# EAGLE schematic MouseSchematic (EAGLE 9.7.0)
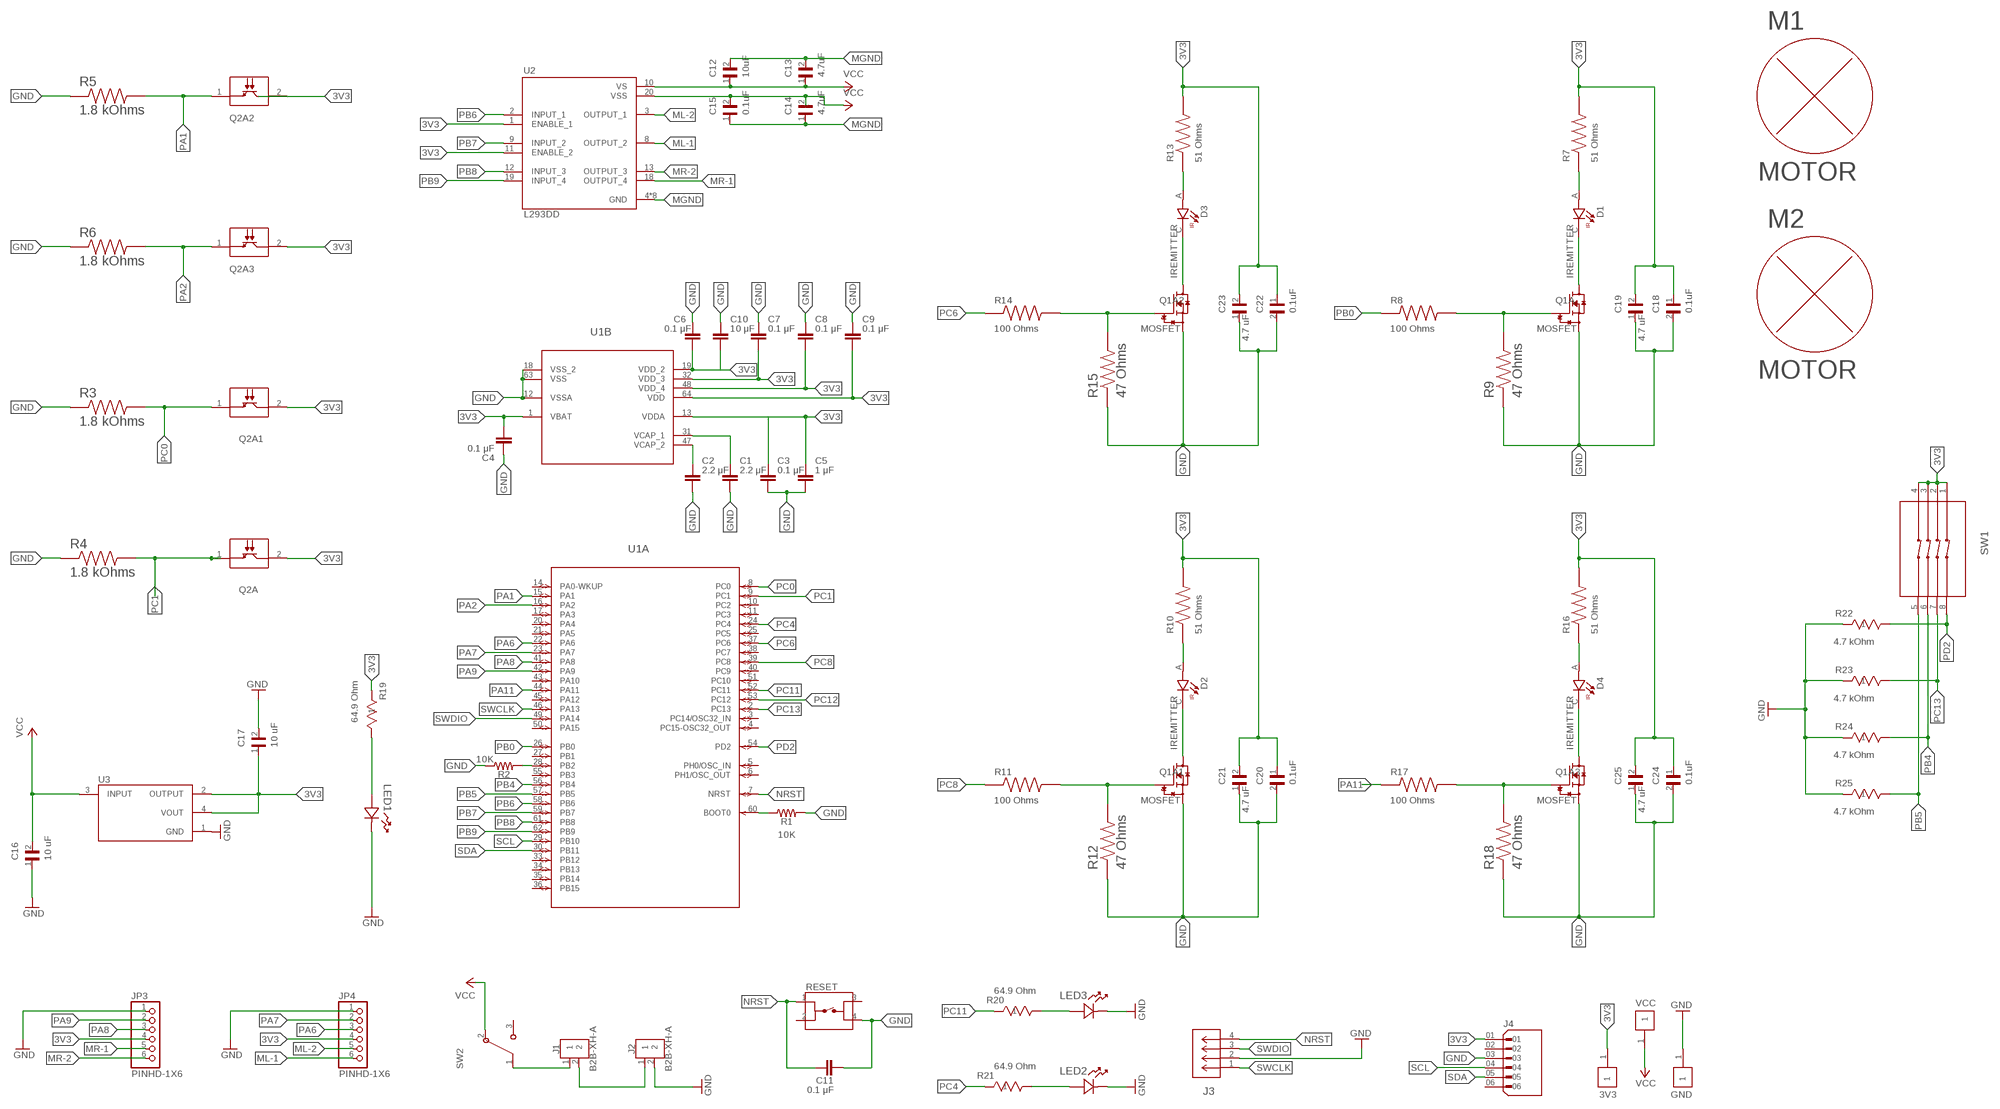
[diagram p0: schematic, sheet 1]

## Parts
3V3  5000  [KEYSTONE_5000]
C1  2.2 μF  C_CHIP-0603(1608-METRIC)  [CAPC1608X85]
C2  2.2 μF  C_CHIP-0603(1608-METRIC)  [CAPC1608X85]
C3  0.1 μF  C_CHIP-0603(1608-METRIC)  [CAPC1608X85]
C4  0.1 μF  C_CHIP-0603(1608-METRIC)  [CAPC1608X85]
C5  1 μF  C_CHIP-0603(1608-METRIC)  [CAPC1608X85]
C6  0.1 μF  C_CHIP-0603(1608-METRIC)  [CAPC1608X85]
C7  0.1 μF  C_CHIP-0603(1608-METRIC)  [CAPC1608X85]
C8  0.1 μF  C_CHIP-0603(1608-METRIC)  [CAPC1608X85]
C9  0.1 μF  C_CHIP-0603(1608-METRIC)  [CAPC1608X85]
C10  10 μF  C_CHIP-0603(1608-METRIC)  [CAPC1608X85]
C11  0.1 μF  C_CHIP-0603(1608-METRIC)  [CAPC1608X85]
C12  10uF  GRM21BR61C106KE15L  [CAPC2012X135N]
C13  4.7uF  GRM21BR71C475KE51L  [CAPC2012X140N]
C14  4.7uF  GRM21BR71C475KE51L  [CAPC2012X140N]
C15  0.1uF  C0805C104K4RAC  [CAPC2012X88N]
C16  10 uF  GRM21BR61C106KE15L  [CAPC2012X135N]
C17  10 uF  C2012X5R1C226K125AC  [CAPC2012X145N]
C18  0.1uF  CL21B104KCFNNNE  [CAPC2012X140N]
C19  4.7 uF  GRM21BR71C475KE51L  [CAPC2012X140N]
C20  0.1uF  CL21B104KCFNNNE  [CAPC2012X140N]
C21  4.7 uF  GRM21BR71C475KE51L  [CAPC2012X140N]
C22  0.1uF  CL21B104KCFNNNE  [CAPC2012X140N]
C23  4.7 uF  GRM21BR71C475KE51L  [CAPC2012X140N]
C24  0.1uF  CL21B104KCFNNNE  [CAPC2012X140N]
C25  4.7 uF  GRM21BR71C475KE51L  [CAPC2012X140N]
D1  IREMITTER  TSAL6200  [LEDRD254W55D595H900]
D2  IREMITTER  TSAL6200  [LEDRD254W55D595H900]
D3  IREMITTER  TSAL6200  [LEDRD254W55D595H900]
D4  IREMITTER  TSAL6200  [LEDRD254W55D595H900]
GND  5000  [KEYSTONE_5000]
J1  B2B-XH-A  [B2B-XH-A]
J2  B2B-XH-A  [B2B-XH-A]
J3  PPTC041LFBN-RCCONN_PPTC041LFBN-RC_SUL  [CONN_PPTC041LFBN-RC_SUL]
J4  61300611121  [WURTH_61300611121]
JP3  PINHD-1X6  [1X06]
JP4  PINHD-1X6  [1X06]
LED1  CMD17-21VGD_TR8  [LED_CMD17-21VGD_TR8]
LED2  CMD17-21VGD_TR8  [LED_CMD17-21VGD_TR8]
LED3  CMD17-21VGD_TR8  [LED_CMD17-21VGD_TR8]
M1  MOTOR  [MOTOR]
M2  MOTOR  [MOTOR]
Q1A  MOSFET  NX7002AK,215  [SOT95P230X110-3N]
Q1A1  MOSFET  NX7002AK,215  [SOT95P230X110-3N]
Q1A2  MOSFET  NX7002AK,215  [SOT95P230X110-3N]
Q1A3  MOSFET  NX7002AK,215  [SOT95P230X110-3N]
Q2A  LTR-4206ENONEP157X157-2_LTO  [NONEP157X157-2_LTO]
Q2A1  LTR-4206ENONEP157X157-2_LTO  [NONEP157X157-2_LTO]
Q2A2  LTR-4206ENONEP157X157-2_LTO  [NONEP157X157-2_LTO]
Q2A3  LTR-4206ENONEP157X157-2_LTO  [NONEP157X157-2_LTO]
R1  10K  R-US_CHIP-0603(1608-METRIC)  [RESC1608X60]
R2  10K  R-US_CHIP-0603(1608-METRIC)  [RESC1608X60]
R3  1.8 kOhms  RMCF0805JT1K80  [RESC2012X65N]
R4  1.8 kOhms  RMCF0805JT1K80  [RESC2012X65N]
R5  1.8 kOhms  RMCF0805JT1K80  [RESC2012X65N]
R6  1.8 kOhms  RMCF0805JT1K80  [RESC2012X65N]
R7  51 Ohms  RC0805FR-073R48L  [RESC2012X60N]
R8  100 Ohms  RC0805FR-07100RL  [RESC2012X60N]
R9  47 Ohms  RMCF0805JT47K0  [RESC2012X65N]
R10  51 Ohms  RC0805FR-073R48L  [RESC2012X60N]
R11  100 Ohms  RC0805FR-07100RL  [RESC2012X60N]
R12  47 Ohms  RMCF0805JT47K0  [RESC2012X65N]
R13  51 Ohms  RC0805FR-073R48L  [RESC2012X60N]
R14  100 Ohms  RC0805FR-07100RL  [RESC2012X60N]
R15  47 Ohms  RMCF0805JT47K0  [RESC2012X65N]
R16  51 Ohms  RC0805FR-073R48L  [RESC2012X60N]
R17  100 Ohms  RC0805FR-07100RL  [RESC2012X60N]
R18  47 Ohms  RMCF0805JT47K0  [RESC2012X65N]
R19  64.9 Ohm  RMCF0805FT64R9RES_RMCF0805_STP-L  [RES_RMCF0805_STP-L]
R20  64.9 Ohm  RMCF0805FT64R9RES_RMCF0805_STP-L  [RES_RMCF0805_STP-L]
R21  64.9 Ohm  RMCF0805FT64R9RES_RMCF0805_STP-L  [RES_RMCF0805_STP-L]
R22  4.7 kOhm  RMCF0805JT4K70STA_RMCF0805_STP-L  [STA_RMCF0805_STP-L]
R23  4.7 kOhm  RMCF0805JT4K70STA_RMCF0805_STP-L  [STA_RMCF0805_STP-L]
R24  4.7 kOhm  RMCF0805JT4K70STA_RMCF0805_STP-L  [STA_RMCF0805_STP-L]
R25  4.7 kOhm  RMCF0805JT4K70STA_RMCF0805_STP-L  [STA_RMCF0805_STP-L]
RESET  FSM4JSMA  [TE_FSM4JSMA]
SW1  219-4MSTR219-4-M_CTS-L  [219-4-M_CTS-L]
SW2  EG1218SW_1218_EWI  [SW_1218_EWI]
U1  STM32F205RGT6  [LQFP64-10X10MM]
U2  L293DD  [SOIC127P1032X265-20N]
U3  AZ1117IH-3.3TRG1  [SOT230P700X185-4N]
VCC  5000  [KEYSTONE_5000]

## Nets
3V3: 3V3.1 C3.1 C4.2 C5.1 C6.2 C7.2 C8.2 C9.2 C10.2 C17.1 C18.1 C19.2 C20.1 C21.2 C22.1 C23.2 C24.1 C25.2 J4.01 JP3.4 JP4.4 Q2A1.2 Q2A2.2 Q2A3.2 Q2A.2 R7.2 R10.2 R13.2 R16.2 R19.1 SW1.1 SW1.2 SW1.3 SW1.4 U1.1(B:VBAT) U1.13(B:VDDA) U1.19(B:VDD_2) U1.32(B:VDD_3) U1.48(B:VDD_4) U1.64(B:VDD) U2.1(ENABLE_1) U2.11(ENABLE_2) U3.2(OUTPUT) U3.4(VOUT)
GND: C1.2 C2.2 C3.2 C4.1 C5.2 C6.1 C7.1 C8.1 C9.1 C10.1 C11.2 C16.1 C17.2 C18.2 C19.1 C20.2 C21.1 C22.2 C23.1 C24.2 C25.1 GND.1 J2.2 J3.2 J4.03 JP3.1 JP4.1 LED1.2 LED2.2 LED3.2 Q1A1.2(S) Q1A2.2(S) Q1A3.2(S) Q1A.2(S) R1.2 R2.1 R3.1 R4.1 R5.1 R6.1 R9.1 R12.1 R15.1 R18.1 R22.1 R23.1 R24.1 R25.1 RESET.4 U1.12(B:VSSA) U1.18(B:VSS_2) U1.63(B:VSS) U3.1(GND)
MGND: C12.2 C13.2 C14.1 C15.1 U2.4(GND) U2.5(GND) U2.6(GND) U2.7(GND) U2.14(GND) U2.15(GND) U2.16(GND) U2.17(GND)
ML-1: JP4.6 U2.8(OUTPUT_2)
ML-2: JP4.5 U2.3(OUTPUT_1)
MR-1: JP3.5 U2.18(OUTPUT_4)
MR-2: JP3.6 U2.13(OUTPUT_3)
N$1: C1.1 U1.31(B:VCAP_1)
N$2: C2.1 U1.47(B:VCAP_2)
N$3: R1.1 U1.60(A:BOOT0)
N$4: R2.2 U1.28(A:PB2)
N$5: D1.A R7.1
N$6: Q1A.1(G) R8.2 R9.2
N$7: J1.2 J2.1
N$8: J1.1 SW2.1
N$9: D1.C Q1A.3(D)
N$10: D2.A R10.1
N$11: Q1A1.1(G) R11.2 R12.2
N$12: D2.C Q1A1.3(D)
N$13: D3.A R13.1
N$14: Q1A2.1(G) R14.2 R15.2
N$15: D3.C Q1A2.3(D)
N$16: D4.A R16.1
N$17: Q1A3.1(G) R17.2 R18.2
N$18: D4.C Q1A3.3(D)
N$19: LED3.1 R20.2
N$20: LED2.1 R21.2
N$21: LED1.1 R19.2
NRST: C11.1 J3.4 RESET.1 U1.7(A:NRST)
PA1: Q2A2.1 R5.2 U1.15(A:PA1)
PA2: Q2A3.1 R6.2 U1.16(A:PA2)
PA6: JP4.3 U1.22(A:PA6)
PA7: JP4.2 U1.23(A:PA7)
PA8: JP3.3 U1.41(A:PA8)
PA9: JP3.2 U1.42(A:PA9)
PA11: R17.1 U1.44(A:PA11)
PB0: R8.1 U1.26(A:PB0)
PB4: R24.2 SW1.6 U1.56(A:PB4)
PB5: R25.2 SW1.5 U1.57(A:PB5)
PB6: U1.58(A:PB6) U2.2(INPUT_1)
PB7: U1.59(A:PB7) U2.9(INPUT_2)
PB8: U1.61(A:PB8) U2.12(INPUT_3)
PB9: U1.62(A:PB9) U2.19(INPUT_4)
PC0: Q2A1.1 R3.2 U1.8(A:PC0)
PC1: Q2A.1 R4.2 U1.9(A:PC1)
PC4: R21.1 U1.24(A:PC4)
PC6: R14.1 U1.37(A:PC6)
PC8: R11.1 U1.39(A:PC8)
PC11: R20.1 U1.52(A:PC11)
PC12: U1.53(A:PC12)
PC13: R23.2 SW1.7 U1.2(A:PC13)
PD2: R22.2 SW1.8 U1.54(A:PD2)
SCL: J4.04 U1.29(A:PB10)
SDA: J4.05 U1.30(A:PB11)
SWCLK: J3.1 U1.46(A:PA13)
SWDIO: J3.3 U1.49(A:PA14)
VCC: C12.1 C13.1 C14.2 C15.2 C16.2 SW2.2 U2.10(VS) U2.20(VSS) U3.3(INPUT) VCC.1
Unconnected: J4.02 J4.06 RESET.2 RESET.3 SW2.3 U1.3(A:PC14/OSC32_IN) U1.4(A:PC15-OSC32_OUT) U1.5(A:PH0/OSC_IN) U1.6(A:PH1/OSC_OUT) U1.10(A:PC2) U1.11(A:PC3) U1.14(A:PA0-WKUP) U1.17(A:PA3) U1.20(A:PA4) U1.21(A:PA5) U1.25(A:PC5) U1.27(A:PB1) U1.33(A:PB12) U1.34(A:PB13) U1.35(A:PB14) U1.36(A:PB15) U1.38(A:PC7) U1.40(A:PC9) U1.43(A:PA10) U1.45(A:PA12) U1.50(A:PA15) U1.51(A:PC10) U1.55(A:PB3)

## Library data of the parts
3V3 GND VCC = Keystone Test Point:5000: Check availability <https://pricing.snapeda.com/parts/5000/Keystone%20Electronics/view-part?ref=eda>; AVAILABILITY: In Stock; DESCRIPTION: PC Test Point - Miniature; MF: Keystone Electronics; MP: 5000; PACKAGE: Test Point Keystone Electronics; PRICE: None; PURCHASE-URL: https://pricing.snapeda.com/search/part/5000/?ref=eda
C1-C6 = Capacitor:C: Capacitor - Generic; CATEGORY: Capacitor
C7-C11 = Capacitor2:C: Capacitor - Generic; CATEGORY: Capacitor
C12 C16 = Capacitor 10 uF:GRM21BR61C106KE15L
C13 C14 C19 C21 C23 C25 = Capacitor 4.7uF:GRM21BR71C475KE51L: SMD Capacitor X7R(EIA) with Capacitance: 4.7uF Tol. 10%. Rated Voltage: 16Vdc
C15 = C0805C104K4RAC:C0805C104K4RAC: Cap Ceramic 0.1uF 16V X7R 10% Pad SMD 0805 125C Bulk; CHECK_PRICES: https://www.snapeda.com/parts/C0805C104K4RAC/KEMET/view-part/?ref=eda; DESCRIPTION: 0.1µF ±10% 16V Ceramic Capacitor X7R 0805 (2012 Metric); MF: KEMET; MP: C0805C104K4RAC; PACKAGE: 0805 Kemet; SNAPEDA_LINK: https://www.snapeda.com/parts/C0805C104K4RAC/KEMET/view-part/?ref=snap
C17 = Capacitor_22uF:C2012X5R1C226K125AC: 22µF ±10% 16V Ceramic Capacitor X5R 0805 (2012 Metric)
C18 C20 C22 C24 = Cap0-1uF:CL21B104KCFNNNE: CL21 Series 0.1 uF 100V ±10 % Tolerance X7R SMT Multilayer Ceramic Capacitor
D1-D4 = emitter:TSAL6200: 940 nm 100 mA ±17° Through Hole High Power Infrared Emitting Diode - T-1 3/4; MANUFACTURER: Vishay; MAXIMUM_PACKAGE_HEIGHT: 9.0 mm; PARTREV: 2.4; STANDARD: IPC-7351B
J1 J2 = Connector:B2B-XH-A: XH Connector Top Entry - 2POS Details see: Datasheet <http://www.jst-mfg.com/product/pdf/eng/eXH.pdf>; CATEGORY: Header; DESCRIPTION: Connector Header Through Hole 2 position 0.098" (2.50mm); MANUFACTURER: JST Sales America Inc.; MPN: B2B-XH-A(LF)(SN); OPERATING_TEMPERATURE: -25°C ~ 85°C; PART_STATUS: ACTIVE; PITCH: 0.098" (2.50mm); ROHS_COMPLIANCE: ROHS3 Compliant; SERIES: XH; SUB_CATEGORY: Rectangular Connectors; TYPE: Header, Male Pin, Board to Cable/Wire, Through Hole
J3 = programmingheader:PPTC041LFBN-RC; COPYRIGHT: Copyright (C) 2024 Ultra Librarian. All rights reserved.; MANUFACTURER_PART_NUMBER: PPTC041LFBN-RC; MFR_NAME: Sullins
J4 = IMU_header:61300611121: Check availability <https://pricing.snapeda.com/parts/61300611121/W%C3%BCrth%20Elektronik/view-part?ref=eda>; AVAILABILITY: In Stock; DESCRIPTION: Connector Header Through Hole 6 position 0.100 (2.54mm); MF: Würth Elektronik; MP: 61300611121; PACKAGE: None; PRICE: None; PURCHASE-URL: https://pricing.snapeda.com/search/part/61300611121/?ref=eda
JP3 JP4 = Connector:PINHD-1X6: PIN HEADER; CATEGORY: Headers; DESCRIPTION: Header, Straight, 6 Position; MANUFACTURER: Generic; MPN: Generic; OPERATING_TEMPERATURE: Generic; PART_STATUS: Active; PITCH: 0.100" (2.54mm); ROHS_COMPLIANCE: Generic; SERIES: Generic; SUB-CATEGORY: Headers, Male Pins; TYPE: Board to Board or Cable, Unshrouded, Through Hole, Straight
LED1-LED3 = SNAPgreenLED:CMD17-21VGD_TR8: LED, GREEN, 7MCD, 570NM; LEDCOLOR: Green; MPN: CMD17-21VGD_TR8; OC_FARNELL: -; OC_NEWARK: 34C8662; PACKAGE: 2 -PIN LED; SUPPLIER: CHICAGO MINIATURE LIGHTING
M1 M2 = micromouseMotors:MOTOR
Q1A Q1A1-Q1A3 = MOSFET_SMD:NX7002AK,215: N-Channel 60 V 4.5 Ohm 265 mW 0.33 nC Surface Mount Mosfet - SOT-23; MANUFACTURER: Nexperia; MAXIMUM_PACKAGE_HEIGHT: 1.1mm; PARTREV: 7; STANDARD: IPC-7351B
Q2A Q2A1-Q2A3 = Phototransistor:LTR-4206E; COPYRIGHT: Copyright (C) 2024 Ultra Librarian. All rights reserved.; MANUFACTURER_PART_NUMBER: LTR-4206E; MFR_NAME: LITE-ON
R1 R2 = Resistor2:R-US: Resistor Fixed - ANSI; CATEGORY: Resistor; SUB-CATEGORY: Fixed
R3-R6 = Resistor1.8kOhms:RMCF0805JT1K80; CHECK_PRICES: https://www.snapeda.com/parts/RMCF0805JT1K80/Stackpole+Electronics+Inc/view-part/?ref=eda; DESCRIPTION: 1.8 kOhms ±5% 0.125W, 1/8W Chip Resistor 0805 (2012 Metric) Automotive AEC-Q200 Thick Film; DIGIKEY_PART_NUMBER: RMCF0805JT1K80TR-ND; MF: Stackpole Electronics Inc; MP: RMCF0805JT1K80; PACKAGE: 2012 Stackpole; PURCHASE-URL: https://www.snapeda.com/api/url_track_click_mouser/?unipart_id=3950781&manufacturer=Stackpole Electronics Inc&part_name=RMCF0805JT1K80&search_term=None; SNAPEDA_LINK: https://www.snapeda.com/parts/RMCF0805JT1K80/Stackpole+Electronics+Inc/view-part/?ref=snap
R7 R10 R13 R16 = LEDCurrentResistor51Ohms:RC0805FR-073R48L: Res Thick Film 0805 3.48 Ohm 1% 0.125W(1/8W) ±200ppm/C Epoxy Pad SMD T/R
R8 R11 R14 R17 = MCU Pin Current Limiter Resistor 100 Ohms:RC0805FR-07100RL: Resistor SMD [YAGEO] RC0805FR-07100RL Resistor SMD
R9 R12 R15 R18 = RMCF0805JT47K0:RMCF0805JT47K0
R19-R21 = Resistor64.9Ohm:RMCF0805FT64R9; COPYRIGHT: Copyright (C) 2024 Ultra Librarian. All rights reserved.; MANUFACTURER_PART_NUMBER: RMCF0805FT64R9; MFR_NAME: Stackpole International
R22-R25 = PullDownResistor4.7Ohms:RMCF0805JT4K70; COPYRIGHT: Copyright (C) 2024 Ultra Librarian. All rights reserved.; MANUFACTURER_PART_NUMBER: RMCF0805JT4K70; MFR_NAME: Stackpole International
RESET = FSM4JSMA:FSM4JSMA: Switch Tactile OFF (ON) SPST Round Button Gull Wing 0.05A 24VDC 2.6N SMD T/R; COMMENT: 4-1437565-1; CONFIGURATION_POLE-THROW: Single Pole - Single Throw; CONTACT_CURRENT_RATING: 50 mA; DESCRIPTION: Tactile Switch SPST-NO Top Actuated Surface Mount; DIGI-KEY_PART_NUMBER: 450-1759-2-ND; EU_ROHS_COMPLIANCE: Compliant; MF: TE Connectivity; MP: FSM4JSMA; PACKAGE: None; PURCHASE-URL: https://pricing.snapeda.com/search/part/FSM4JSMA/?ref=eda
SW1 = DipSwitch4Pin:219-4MSTR; COPYRIGHT: Copyright (C) 2024 Ultra Librarian. All rights reserved.; MANUFACTURER_PART_NUMBER: 219-4MSTR; MFR_NAME: CTS Components
SW2 = powerswitch:EG1218; COPYRIGHT: Copyright (C) 2024 Ultra Librarian. All rights reserved.; MANUFACTURER_PART_NUMBER: EG1218; MFR_NAME: E-Switch
U1 = stm32f205rgt6:STM32F205RGT6; COPYRIGHT: Copyright (C) 2021 Ultra Librarian. All rights reserved.; MANUFACTURER_PART_NUMBER: STM32F205RGT6; MFR_NAME: STMicroelectronics
U2 = L293DD:L293DD: L293DD Series Push - Pull Quad Channel Driver with Diodes - SOIC-20; MANUFACTURER: STMicroelectronics; PARTREV: N/A; STANDARD: IPC-7351B
U3 = AZ1117IH-3.3TRG1:AZ1117IH-3.3TRG1: Check availability <https://pricing.snapeda.com/parts/AZ1117IH-3.3TRG1/Diodes%20Inc./view-part?ref=eda>; AVAILABILITY: In Stock; CHECK_PRICES: https://www.snapeda.com/parts/AZ1117IH-3.3TRG1/Diodes+Inc./view-part/?ref=eda; DESCRIPTION: Linear Voltage Regulator IC Positive Fixed 1 Output 1A SOT-223-3; MF: Diodes Inc.; MP: AZ1117IH-3.3TRG1; PACKAGE: SOT-223 Diodes Inc.; PRICE: None; PURCHASE-URL: https://www.snapeda.com/api/url_track_click_mouser/?unipart_id=490259&manufacturer=Diodes Inc.&part_name=AZ1117IH-3.3TRG1&search_term=az1117ih-3.3trg1; SNAPEDA_LINK: https://www.snapeda.com/parts/AZ1117IH-3.3TRG1/Diodes+Inc./view-part/?ref=snap